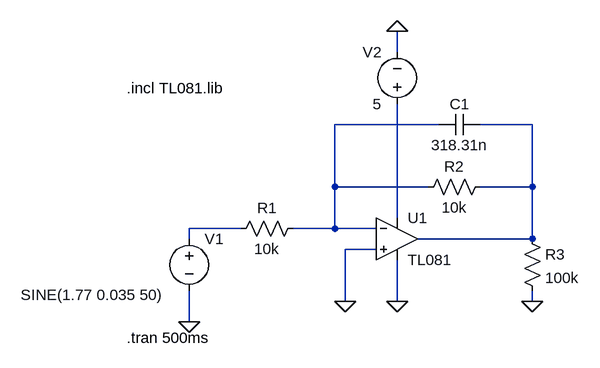
[diagram p0: schematic _Lowpass_Inverting_TL081.asc]
_Lowpass_Inverting_TL081.asc, the LTspice schematic file:
Version 4
SHEET 1 880 680
WIRE 224 -80 224 -112
WIRE 288 32 128 32
WIRE 432 32 352 32
WIRE 128 128 128 32
WIRE 272 128 128 128
WIRE 432 128 432 32
WIRE 432 128 352 128
WIRE 224 176 224 0
WIRE -16 192 -96 192
WIRE 128 192 128 128
WIRE 128 192 64 192
WIRE 192 192 128 192
WIRE -96 208 -96 192
WIRE 432 208 432 128
WIRE 432 208 256 208
WIRE 192 224 144 224
WIRE 144 304 144 224
WIRE 224 304 224 240
WIRE 432 304 432 288
WIRE -96 336 -96 288
FLAG 224 304 0
FLAG 432 304 0
FLAG 144 304 0
FLAG -96 336 0
FLAG 224 -112 0
SYMBOL Opamps\\opamp2 224 144 R0
SYMATTR InstName U1
SYMATTR Value TL081
SYMBOL res 80 176 R90
WINDOW 0 0 56 VBottom 2
WINDOW 3 32 56 VTop 2
SYMATTR InstName R1
SYMATTR Value 10k
SYMBOL res 368 112 R90
WINDOW 0 0 56 VBottom 2
WINDOW 3 32 56 VTop 2
SYMATTR InstName R2
SYMATTR Value 10k
SYMBOL cap 352 16 R90
WINDOW 0 0 32 VBottom 2
WINDOW 3 32 32 VTop 2
SYMATTR InstName C1
SYMATTR Value 318.31n
SYMBOL res 416 192 R0
SYMATTR InstName R3
SYMATTR Value 100k
SYMBOL voltage -96 192 R0
WINDOW 3 -259 102 Left 2
WINDOW 123 24 72 Left 2
WINDOW 39 0 0 Left 0
SYMATTR Value SINE(1.77 0.035 50)
SYMATTR InstName V1
SYMBOL voltage 224 16 R180
WINDOW 0 24 96 Left 2
WINDOW 3 24 16 Left 2
WINDOW 123 0 0 Left 0
WINDOW 39 0 0 Left 0
SYMATTR InstName V2
SYMATTR Value 5
TEXT -192 -24 Left 2 !.incl TL081.lib
TEXT -192 360 Left 2 !.tran 500ms

The netlist it stands for:
* _Lowpass_Inverting_TL081.asc
XU1 0 N001 N003 0 N002 TL081  ; pins In+ In- V+ V- OUT
R1 N001 N004 10k
R2 N002 N001 10k
C1 N002 N001 318.31n
R3 N002 0 100k
V1 N004 0 SINE(1.77 0.035 50)
V2 N003 0 5
.incl TL081.lib
.tran 500ms
.backanno
.end